# EasyEDA schematic 4.78.json
TITLE: Sheet_1; REV: 1.0; Date: 2020-11-18; Sheet: 1/1; Drawn By: Gökbey Keskin; Company: Your Company
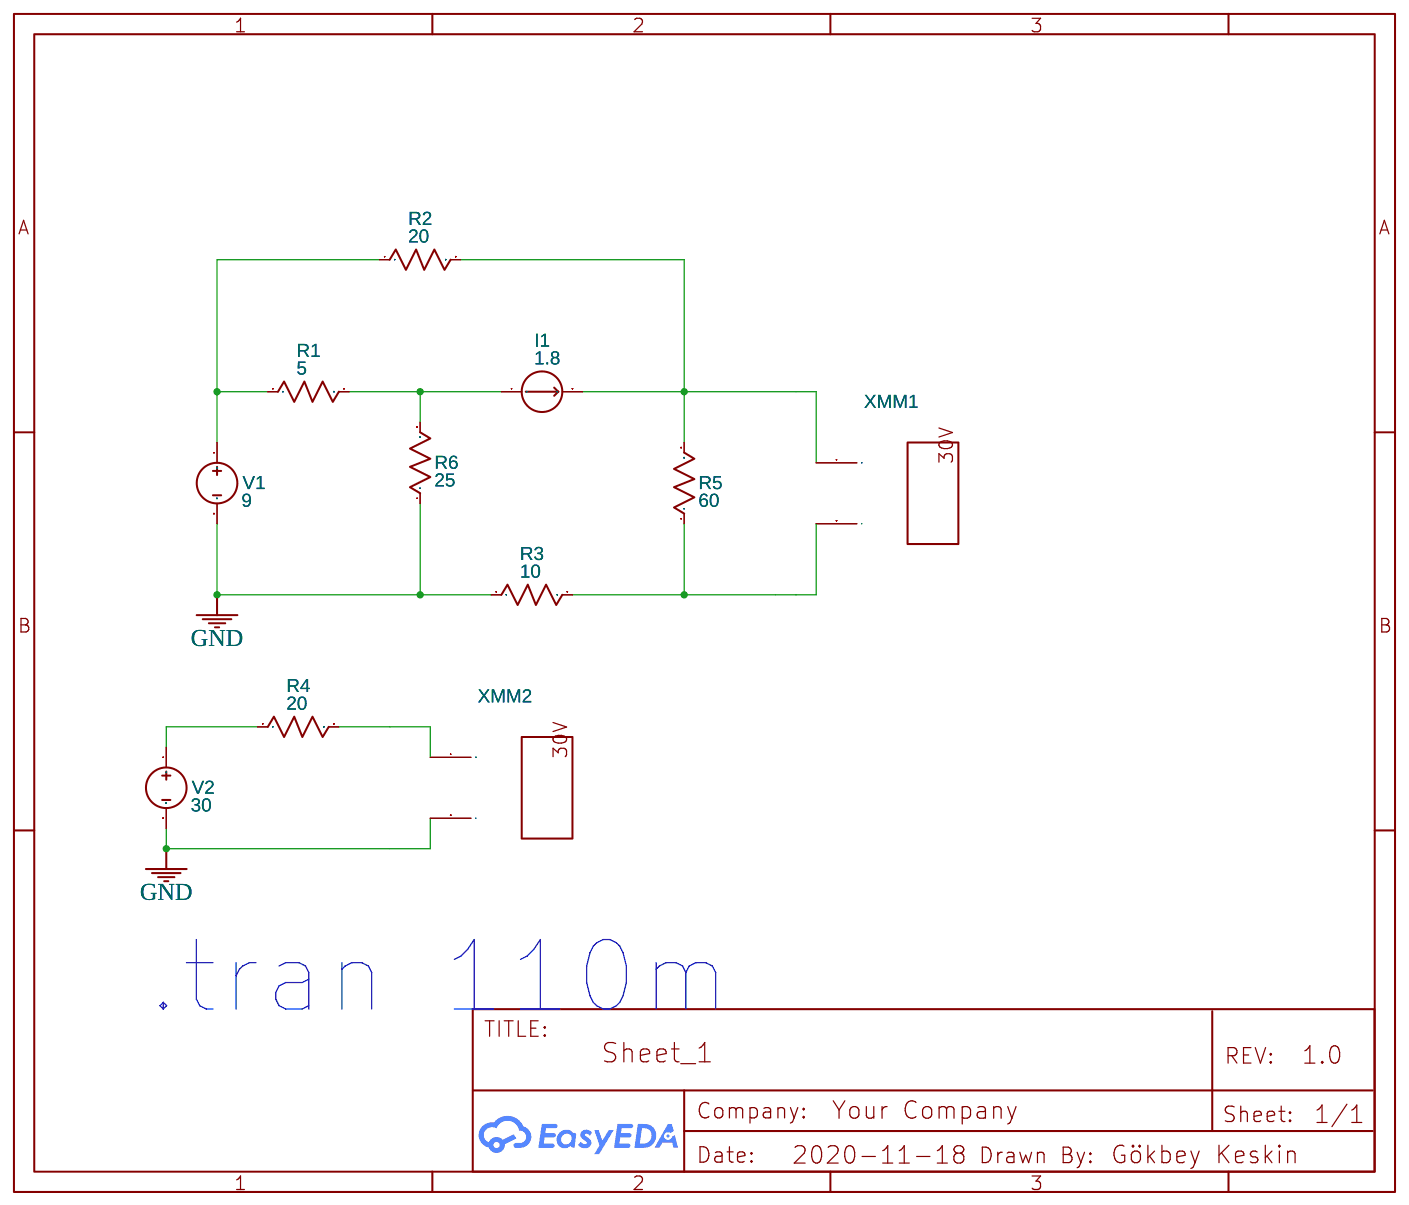
[diagram p0: schematic sheet]

## Parts
I1  1.8  [2P-5.08]
R1  5  [AXIAL-0.3]
R2  20  [AXIAL-0.3]
R3  10  [AXIAL-0.3]
R4  20  [AXIAL-0.3]
R5  60  [AXIAL-0.3]
R6  25  [AXIAL-0.3]
V1  9  [HDR1X2]
V2  30  [HDR1X2]
XMM1  Multimeter
XMM2  Multimeter

## Library data of the parts
I1 = IDC: Contributor: EasyEDA; sim: true
R1-R6 = Resistor_US: Resistance: 1k; Contributor: EasyEDA; Supplier: YUJING
V1 V2 = VDC: Contributor: EasyEDA; sim: true
XMM1 XMM2 = MULTIMETER: Supplier: LCSC; Multimeter Type: Voltmeter; Power Type: AC; Voltmeter resistance: 10μ; Ammeter resistance: 1G; NameDisplay: 0; Contributor: EasyEDA; sim: true

## Nets
GND: R3.1 R6.1 V1.2 V2.2 XMM2.2(I)
Net-(I1-1): I1.1 R1.2 R6.2
Net-(I1-2): I1.2 R2.2 R5.2 XMM1.1(+)
Net-(R1-1): R1.1 R2.1 V1.1
Net-(R3-2): R3.2 R5.1 XMM1.2(I)
Net-(R4-1): R4.1 V2.1
Net-(R4-2): R4.2 XMM2.1(+)

## Notes on the sheet
- .tran 110m
